# Altium schematic sheet 主电路.SchDoc
size A3
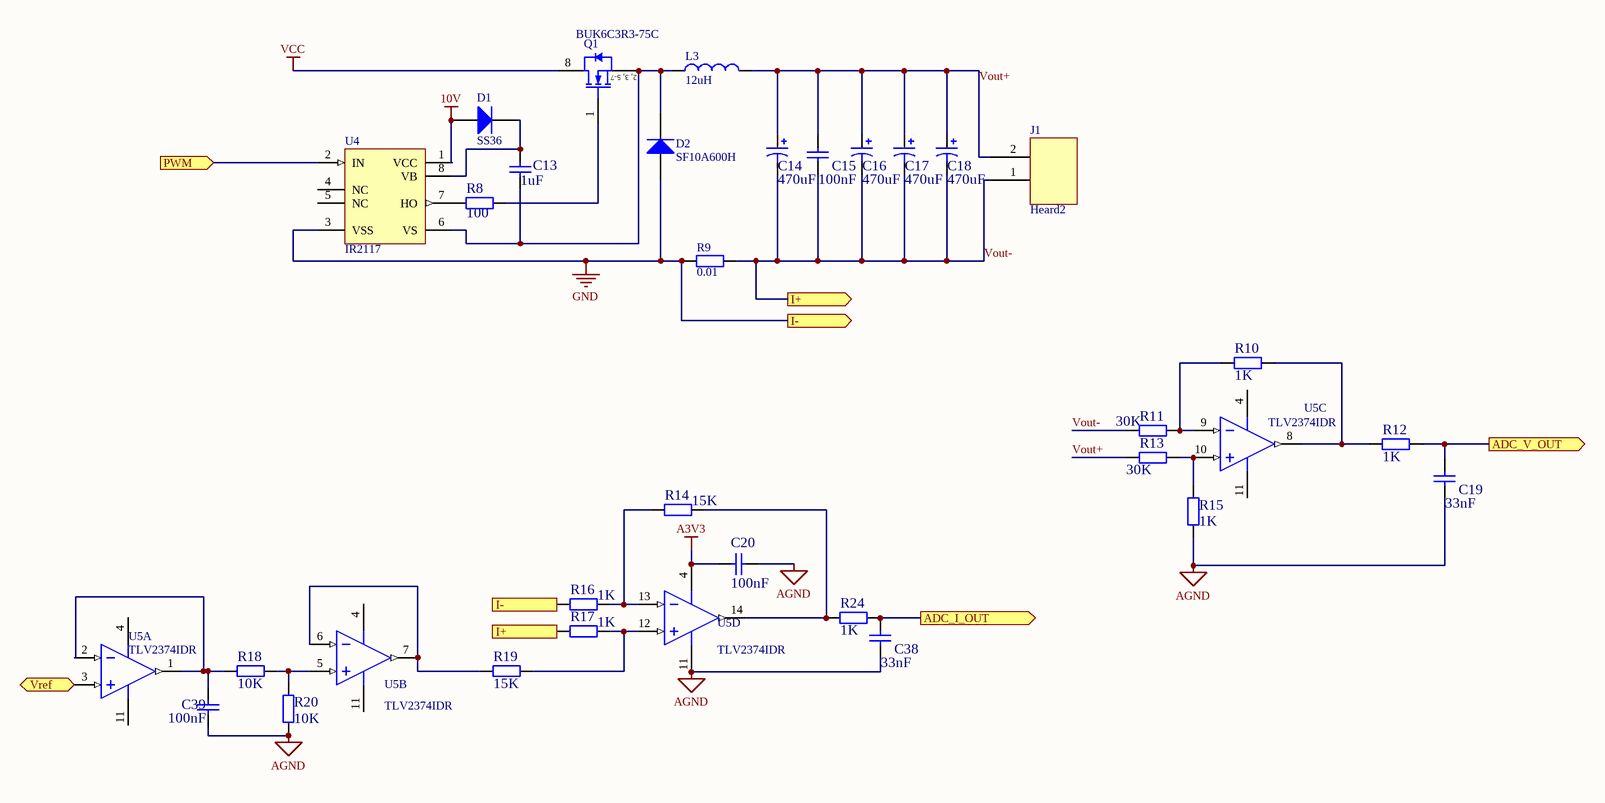
[diagram p0: 主电路.SchDoc]

## Parts
C13  1uF  [0805R]
C14  value 470uF  [RB-220T]  (hidden comment: Cap Pol1)
C15  100nF  [0805_C]
C16  value 470uF  [RB-220T]  (hidden comment: Cap Pol1)
C17  value 470uF  [RB-220T]  (hidden comment: Cap Pol1)
C18  value 470uF  [RB-220T]  (hidden comment: Cap Pol1)
C19  33nF  [0805_C]
C20  100nF  [0805_C]
C38  33nF  [0805_C]
C39  100nF  [0805_C]
D1  SS36  [SMC(DO-214AB)_S1]
D2  SF10A600H  [SMC(DO-214AB)_S1]
J1  Heard2  [8.5端子]
L3  12uH  [L_12uh]
Q1  BUK6C3R3-75C  [NXP-SOT427_N]
R8  100  [0805R]
R9  0.01  [水泥电阻]
R10  1K  [0805R]
R11  30K  [0805R]
R12  1K  [0805R]
R13  30K  [0805R]
R14  15K  [0805R]
R15  1K  [0805R]
R16  1K  [0805R]
R17  1K  [0805R]
R18  10K  [0805R]
R19  15K  [0805R]
R20  10K  [0805R]
R24  1K  [0805R]
U4  IR2117  [PDIP8]
U5  TLV2374IDR  [TI-D14_N]  (parts A,B,C,D of 4)

## Ports
ADC_I_OUT (out), ADC_V_OUT (out), I+ (in), I+ (out), I- (in), I- (out), PWM (in), Vref (bidir)

## Nets
10V: D1.1(A) U4.1(VCC)
A3V3: C20.2 U5.4(VDD)
AGND: C19.1 C20.1 C38.1 C39.1 R15.2 R20.2 U5.11(GND)
GND: D2.1(A) R9.1 R16.2 U4.3(VSS) ; port I-
VCC: Q1.8(D)
ADC_I_OUT: C38.2 R24.2 ; port ADC_I_OUT
ADC_V_OUT: C19.2 R12.2 ; port ADC_V_OUT
PWM: U4.2(IN) ; port PWM
Vout+: C14.1 C15.2 C16.1 C17.1 C18.1 J1.2 L3.2 R13.2
Vout-: C14.2 C15.1 C16.2 C17.2 C18.2 J1.1 R9.2 R11.2 R17.2 ; port I+
Vref: U5.3(IN1+) ; port Vref
NetC13_1: C13.1 D1.2(K) U4.8(VB)
NetC13_2: C13.2 D2.2(K) L3.1 Q1.2(S) Q1.3(S) Q1.5(S) Q1.6(S) Q1.7(S) U4.6(VS)
NetC39_2: C39.2 R18.1 U5.1(OUT1) U5.2(IN1-)
NetQ1_1: Q1.1(G) R8.2
NetR8_1: R8.1 U4.7(HO)
NetR10_1: R10.1 R11.1 U5.9(IN3-)
NetR10_2: R10.2 R12.1 U5.8(OUT3)
NetR13_1: R13.1 R15.1 U5.10(IN3+)
NetR14_1: R14.1 R24.1 U5.14(OUT4)
NetR14_2: R14.2 R16.1 U5.13(IN4-)
NetR17_1: R17.1 R19.2 U5.12(IN4+)
NetR18_2: R18.2 R20.1 U5.5(IN2+)
NetR19_1: R19.1 U5.6(IN2-) U5.7(OUT2)

Not connected (* = marked no-connect by the designer): U4 4(NC) 5(NC)

## Notes on the sheet
- (in symbol BUK6C3R3-75C,118) 2, 3, 5-7

## Library data of the parts
C13 = Cap: Capacitor; Published: 8-Jun-2000; LatestRevisionDate: 17-Jul-2002; LatestRevisionNote: Re-released for DXP Platform.; PackageReference: RAD-0.3; Publisher: Altium Limited; PackageDescription: Radial Cap, Thru-Hole; 2 Leads; 0.3 in Pin Spacing; Value: 1uF
C14 C16-C18 = Cap Pol1: Polarized Capacitor (Radial); Published: 8-Jun-2000; LatestRevisionDate: 17-Jul-2002; LatestRevisionNote: Re-released for DXP Platform.; PackageReference: RB7.6-15; Publisher: Altium Limited; PackageDescription: Polarized Capacitor (Radial); 2 Leads
C15 C19 C20 C38 C39 = 0805 100nF(104) 10% 50V: 贴片电容; ComponentLink1Description: 供应商链接; ComponentLink1URL: http://www.szlcsc.com/product/details_50686.html; Package: 0805; Supplier: LC; SuppliersPartNumber: C49678
D1 D2 = SMC(DO-214AB) SS36-E3/57T: 二极管; ComponentLink1Description: 供应商链接; ComponentLink1URL: http://www.szlcsc.com/product/details_36698.html; Package: SMC(DO-214AB); Supplier: LC; SuppliersPartNumber: C35722
J1 = Header2
L3 = L_12uh
Q1 = BUK6C3R3-75C,118: N-Channel TrenchMOS Intermediate Level FET, 75 V, 181 A, 7-Pin SOT427, Tape and Reel; Manufacturer: NXP Semiconductors; Automotive Qualified: Y; Channel Type: N; ID [max] (A): 181; IDM [max] (A): 723; Packing: Tape & Reel; Qr [typ] (nC): 165; VDS [max] (V): 75; VGSth [typ] (V): 2.3; DatasheetVersion: Rev. 3; PackageVersion: 12-10-16, 10/2012; PackageReference: SOT427; PackageDescription: 7-Pin Plastic Single-ended Surface Mounted Package, Body 10 x 9.6 mm, Pitch 1.27 mm; Supplier 1: Digi-Key; Supplier Part Number 1: 568-9503-2-ND; Supplier 2: Digi-Key; Supplier Part Number 2: 568-9503-1-ND; Supplier 3: Digi-Key; Supplier Part Number 3: 568-9503-6-ND; Supplier 4: Mouser; Supplier Part Number 4: 771-BUK6C3R3-75C,118; Mounting Technology: Surface Mount; PartNumber: BUK6C3R3-75C,118; ComponentLink1Description: Manufacturer URL; ComponentLink1URL: http://www.nxp.com/; ComponentLink2Description: Datasheet; ComponentLink2URL: http://www.nxp.com/documents/data_sheet/BUK6C3R3-75C.pdf; ComponentLink3Description: Package Specification; ComponentLink3URL: http://www.nxp.com/documents/outline_drawing/sot427_po.pdf
R8 R10-R20 R24 = Res2: Resistor; Published: 8-Jun-2000; LatestRevisionDate: 17-Jul-2002; LatestRevisionNote: Re-released for DXP Platform.; PackageReference: AXIAL-0.4; Publisher: Altium Limited; PackageDescription: Axial Device, Thru-Hole; 2 Leads; 0.4 in Pin Spacing
  R8: Value: 100
  R10 R12 R15-R17 R24: Value: 1K
  R11 R13: Value: 30K
  R14 R19: Value: 15K
  R18 R20: Value: 10K
R9 = 水泥电阻
U4 = IR2117: Single Channel Driver; Note: Pins 4 and 5 not connected (NC).; Published: 8-Jun-2000; LatestRevisionDate: 04-Mar-2005; LatestRevisionNote: Stylized 3D Model Added.; DatasheetVersion: PD60146I; PackageReference: PDIP8; Publisher: Altium Limited; PackageDescription: DIP; 8 Leads; Row Spacing 7.62 mm; Pitch 2.54 mm; Code_JEDEC: MO-001-AN; ComponentLink1Description: Manufacturer Link; ComponentLink1URL: http://www.irf.com/; ComponentLink2Description: Datasheet; ComponentLink2URL: http://www.irf.com/product-info/datasheets/data/ir2117.pdf
U5 = TLV2374IDR: 550 uA/Ch, 3 MHz, RRIO Operational Amplifier, 2.7 to 16 V, -40 to 125 degC, 14-pin SOIC (D14), Green (RoHS & no Sb/Br); Manufacturer: Texas Instruments; CMRR(Min)(dB): 50; GBW(Typ)(MHz): 3; IIB(Max)(pA): 60; Iq per channel(Max)(mA): 0.66; Number of Channels: 4; Offset Drift(Typ)(uV/C): 2; Packing: LARGE T&R; Rating: Catalog; Slew Rate(Typ)(V/us): 2.4; Sub Family: Low Supply Voltage Amplifier (<=2.7V), Precision Amplifier; Total Supply Voltage(Max)(+5V is 5, +/-5V is 10): 16; Total Supply Voltage(Min)(+5V is 5, +/-5V is 10): 2.7; Vio (25C)(Max)(mV): 4.5; DatasheetVersion: SLOS270D; PackageVersion: 4040047-5/M, 06/2011; PackageReference: D14; PackageDescription: 14-Pin Plastic Small Outline, Body 8.65 x 3.9 mm, Pitch 1.27 mm; Supplier 1: Digi-Key; Supplier Part Number 1: 296-11967-2-ND; Supplier 2: Digi-Key; Supplier Part Number 2: 296-11967-1-ND; Supplier 3: Digi-Key; Supplier Part Number 3: 296-11967-6-ND; Supplier 4: Farnell; Supplier Part Number 4: 1535749; Supplier 5: Newark; Supplier Part Number 5: 76C7983; Supplier 6: Mouser; Supplier Part Number 6: 595-TLV2374IDR; Eco-Plan: Green (RoHS & no Sb/Br); Mounting Technology: Surface Mount; Code_JEDEC: MS-012; PartNumber: TLV2374IDR; ComponentLink1Description: Manufacturer URL; ComponentLink1URL: http://www.ti.com/; ComponentLink2Description: Datasheet; ComponentLink2URL: http://www.ti.com/lit/ds/symlink/tlv2374.pdf; ComponentLink3Description: Package Specification; ComponentLink3URL: http://www.ti.com/lit/ml/mpds177g/mpds177g.pdf